# Altium schematic sheet FPGA_U1_Manual.SchDoc
size A4; DocumentNumber: 4; SheetNumber: 4; SheetTotal: 7
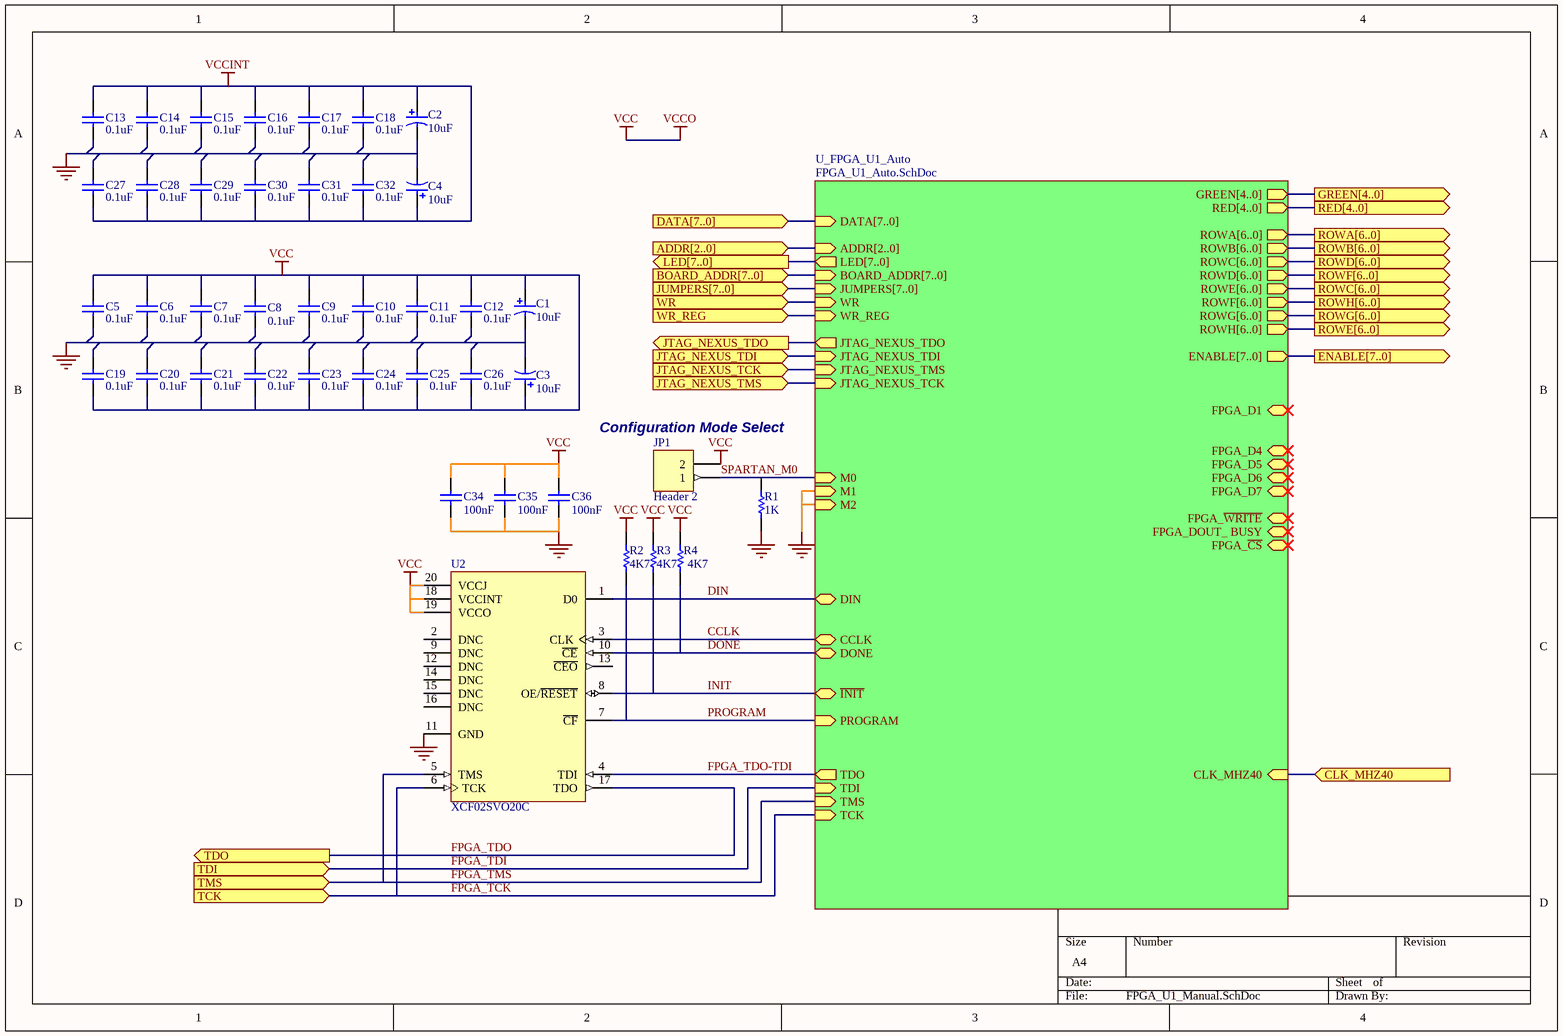
[diagram p0: FPGA_U1_Manual.SchDoc]

## Parts
C1  10uF  [MCCT-B]
C2  10uF  [MCCT-B]
C3  10uF  [MCCT-B]
C4  10uF  [MCCT-B]
C5  0.1uF  [CC2012-0805]
C6  0.1uF  [CC2012-0805]
C7  0.1uF  [CC2012-0805]
C8  0.1uF  [CC2012-0805]
C9  0.1uF  [CC2012-0805]
C10  0.1uF  [CC2012-0805]
C11  0.1uF  [CC2012-0805]
C12  0.1uF  [CC2012-0805]
C13  0.1uF  [CC2012-0805]
C14  0.1uF  [CC2012-0805]
C15  0.1uF  [CC2012-0805]
C16  0.1uF  [CC2012-0805]
C17  0.1uF  [CC2012-0805]
C18  0.1uF  [CC2012-0805]
C19  0.1uF  [CC2012-0805]
C20  0.1uF  [CC2012-0805]
C21  0.1uF  [CC2012-0805]
C22  0.1uF  [CC2012-0805]
C23  0.1uF  [CC2012-0805]
C24  0.1uF  [CC2012-0805]
C25  0.1uF  [CC2012-0805]
C26  0.1uF  [CC2012-0805]
C27  0.1uF  [CC2012-0805]
C28  0.1uF  [CC2012-0805]
C29  0.1uF  [CC2012-0805]
C30  0.1uF  [CC2012-0805]
C31  0.1uF  [CC2012-0805]
C32  0.1uF  [CC2012-0805]
C34  100nF  [CC2012-0805]
C35  100nF  [CC2012-0805]
C36  100nF  [CC2012-0805]
JP1  Header 2  Usage: Configuration Mode Select  [HDR1X2]
R1  1K  [CC2012-0805]
R2  4K7  [CC2012-0805]
R3  4K7  [CC2012-0805]
R4  4K7  [CC2012-0805]
U2  XCF02SVO20C  [VO20]

## Sub-sheets
U_FPGA_U1_Auto = FPGA_U1_Auto.SchDoc: ADDR[2..0] (in), BOARD_ADDR[7..0] (in), CLK_MHZ40 (in), DATA[7..0] (in), GREEN[4..0] (out), JTAG_NEXUS_TCK (in), JTAG_NEXUS_TDI (in), JTAG_NEXUS_TDO (out), JTAG_NEXUS_TMS (in), LED[7..0] (out), RED[4..0] (out), ROWA[6..0] (out), ROWB[6..0] (out), ROWC[6..0] (out), ROWD[6..0] (out), ROWE[6..0] (out), ROWF[6..0] (out), ROWG[6..0] (out), ROWH[6..0] (out), WR (in), CCLK (bidir), DONE (bidir), FPGA_D7 (bidir), M0 (in), M1 (in), M2 (in), PROGRAM (in), TCK (in), TDI (in), TDO (out), TMS (in), FPGA_DOUT_ BUSY (bidir), FPGA_~{WRITE} (bidir), FPGA_D5 (bidir), FPGA_D6 (bidir), FPGA_~{CS} (bidir), FPGA_D1 (bidir), FPGA_D4 (bidir), ENABLE[7..0] (out), JUMPERS[7..0] (in), DIN (bidir), ~{INIT} (bidir), WR_REG (in)

## Ports
ADDR[2..0] (in), BOARD_ADDR[7..0] (in), CLK_MHZ40 (in), DATA[7..0] (in), ENABLE[7..0] (out), GREEN[4..0] (out), JTAG_NEXUS_TCK (in), JTAG_NEXUS_TDI (in), JTAG_NEXUS_TDO (out), JTAG_NEXUS_TMS (in), JUMPERS[7..0] (in), LED[7..0] (out), RED[4..0] (out), ROWA[6..0] (out), ROWB[6..0] (out), ROWC[6..0] (out), ROWD[6..0] (out), ROWE[6..0] (out), ROWF[6..0] (out), ROWG[6..0] (out), ROWH[6..0] (out), TCK (in), TDI (in), TDO (out), TMS (in), WR (in), WR_REG (in)

## Nets
GND: C1.2 C2.2 C3.2 C4.2 C5.1 C6.1 C7.1 C8.1 C9.1 C10.1 C11.1 C12.1 C13.1 C14.1 C15.1 C16.1 C17.1 C18.1 C19.2 C20.2 C21.2 C22.2 C23.2 C24.2 C25.2 C26.2 C27.2 C28.2 C29.2 C30.2 C31.2 C32.2 C34.1 C35.1 C36.1 R1.1 U2.11(GND) ; sheet U_FPGA_U1_Auto/M1, sheet U_FPGA_U1_Auto/M2
VCC: C1.1 C3.1 C5.2 C6.2 C7.2 C8.2 C9.2 C10.2 C11.2 C12.2 C19.1 C20.1 C21.1 C22.1 C23.1 C24.1 C25.1 C26.1 C34.2 C35.2 C36.2 JP1.2 R2.1 R3.1 R4.1 U2.18(VCCINT) U2.19(VCCO) U2.20(VCCJ)  [also labelled VCCO]
VCCINT: C2.1 C4.1 C13.2 C14.2 C15.2 C16.2 C17.2 C18.2 C27.1 C28.1 C29.1 C30.1 C31.1 C32.1
CCLK: U2.3(CLK) ; sheet U_FPGA_U1_Auto/CCLK
CLK_MHZ40: port CLK_MHZ40, sheet U_FPGA_U1_Auto/CLK_MHZ40
DIN: U2.1(D0) ; sheet U_FPGA_U1_Auto/DIN
DONE: R4.2 U2.10(~{CE}) ; sheet U_FPGA_U1_Auto/DONE
FPGA_TCK: U2.6(TCK) ; port TCK, sheet U_FPGA_U1_Auto/TCK
FPGA_TDI: port TDI, sheet U_FPGA_U1_Auto/TDI
FPGA_TDO: U2.17(TDO) ; port TDO
FPGA_TDO-TDI: U2.4(TDI) ; sheet U_FPGA_U1_Auto/TDO
FPGA_TMS: U2.5(TMS) ; port TMS, sheet U_FPGA_U1_Auto/TMS
INIT: R3.2 U2.8(OE/~{RESET}) ; sheet U_FPGA_U1_Auto/~{INIT}
JTAG_NEXUS_TCK: port JTAG_NEXUS_TCK, sheet U_FPGA_U1_Auto/JTAG_NEXUS_TMS
JTAG_NEXUS_TDI: port JTAG_NEXUS_TDI, sheet U_FPGA_U1_Auto/JTAG_NEXUS_TDI
JTAG_NEXUS_TDO: port JTAG_NEXUS_TDO, sheet U_FPGA_U1_Auto/JTAG_NEXUS_TDO
JTAG_NEXUS_TMS: port JTAG_NEXUS_TMS, sheet U_FPGA_U1_Auto/JTAG_NEXUS_TCK
PROGRAM: R2.2 U2.7(~{CF}) ; sheet U_FPGA_U1_Auto/PROGRAM
SPARTAN_M0: JP1.1 R1.2 ; sheet U_FPGA_U1_Auto/M0
WR: port WR, sheet U_FPGA_U1_Auto/WR
WR_REG: port WR_REG, sheet U_FPGA_U1_Auto/WR_REG

Not connected (* = marked no-connect by the designer): U2 2(DNC) 9(DNC) 12(DNC) 13(~{CEO}) 14(DNC) 15(DNC) 16(DNC)

## Buses and harness runs
bus port ADDR[2..0] = sheet U_FPGA_U1_Auto/ADDR[2..0]
bus port BOARD_ADDR[7..0] = sheet U_FPGA_U1_Auto/BOARD_ADDR[7..0]
bus port DATA[7..0] = sheet U_FPGA_U1_Auto/DATA[7..0]
bus port ENABLE[7..0] = sheet U_FPGA_U1_Auto/ENABLE[7..0]
bus port GREEN[4..0] = sheet U_FPGA_U1_Auto/GREEN[4..0]
bus port JUMPERS[7..0] = sheet U_FPGA_U1_Auto/JUMPERS[7..0]
bus port LED[7..0] = sheet U_FPGA_U1_Auto/LED[7..0]
bus port RED[4..0] = sheet U_FPGA_U1_Auto/RED[4..0]
bus port ROWA[6..0] = sheet U_FPGA_U1_Auto/ROWA[6..0]
bus port ROWB[6..0] = sheet U_FPGA_U1_Auto/ROWB[6..0]
bus port ROWC[6..0] = sheet U_FPGA_U1_Auto/ROWE[6..0]
bus port ROWD[6..0] = sheet U_FPGA_U1_Auto/ROWC[6..0]
bus port ROWE[6..0] = sheet U_FPGA_U1_Auto/ROWH[6..0]
bus port ROWF[6..0] = sheet U_FPGA_U1_Auto/ROWD[6..0]
bus port ROWG[6..0] = sheet U_FPGA_U1_Auto/ROWG[6..0]
bus port ROWH[6..0] = sheet U_FPGA_U1_Auto/ROWF[6..0]

## Library data of the parts
C1-C4 = CAP_POLAR: Polar Capacitor
  C2-C4: Supplier: FARNELL; Supplier Code: 967-117
C5-C32 = CAP: Capacitor; Supplier: FARNELL; Supplier Code: 317-287
C34-C36 = CAP: Capacitor; Fitted: True
JP1 = Header 2: Header, 2-Pin; Manufacturer: Generic Components; Class I: Connector; Fitted: True; Revision: July-2002: Re-released for DXP Platform.; Publisher: Altium Limited
R1-R4 = RES: Resistor; Fitted: True
U2 = XCF02SVO20C: XCF00S Series, Platform Flash In-System Programmable Configuration 3.3V PROM, 20-Pin TSOP, 2-Megabit, Commercial Grade; Manufacturer: Xilinx; Package Information: Latest Revision: ver1.0, May-2003; Code - JEDEC: MO-153-AC; Published: 17-Sep-2003; Datasheet: Latest Revision: ver1.1, Jun-2003; Package Reference: VO20; Publisher: Altium Limited